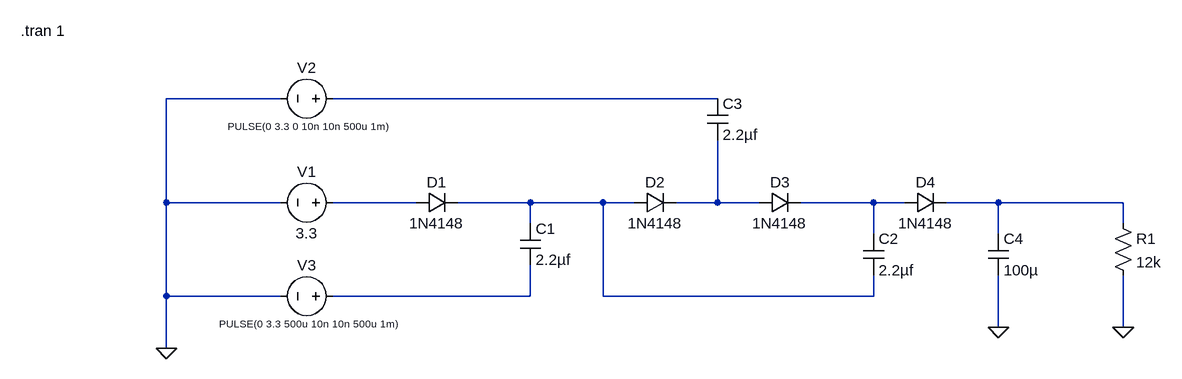
[diagram p0: schematic cockcroft.asc]
cockcroft.asc, the LTspice schematic file:
Version 4.1
SHEET 1 1428 680
WIRE 64 0 -112 0
WIRE 736 0 144 0
WIRE -112 160 -112 0
WIRE 64 160 -112 160
WIRE 272 160 144 160
WIRE 448 160 336 160
WIRE 560 160 448 160
WIRE 608 160 560 160
WIRE 736 160 736 64
WIRE 736 160 672 160
WIRE 800 160 736 160
WIRE 976 160 864 160
WIRE 1024 160 976 160
WIRE 1168 160 1088 160
WIRE 1360 160 1168 160
WIRE 448 192 448 160
WIRE 1360 192 1360 160
WIRE 976 208 976 160
WIRE 1168 208 1168 160
WIRE -112 304 -112 160
WIRE 64 304 -112 304
WIRE 448 304 448 256
WIRE 448 304 144 304
WIRE 560 304 560 160
WIRE 976 304 976 272
WIRE 976 304 560 304
WIRE 1168 352 1168 272
WIRE 1360 352 1360 272
WIRE -112 384 -112 304
FLAG -112 384 0
FLAG 1168 352 0
FLAG 1360 352 0
SYMBOL voltage 160 160 R90
WINDOW 0 -32 56 VBottom 2
WINDOW 3 32 56 VTop 2
WINDOW 123 0 0 Left 0
WINDOW 39 0 0 Left 0
SYMATTR InstName V1
SYMATTR Value 3.3
SYMBOL voltage 160 0 R90
WINDOW 0 -32 56 VBottom 2
WINDOW 3 32 56 VTop 1
WINDOW 123 0 0 Left 0
WINDOW 39 0 0 Left 0
SYMATTR InstName V2
SYMATTR Value PULSE(0 3.3 0 10n 10n 500u 1m)
SYMBOL voltage 160 304 R90
WINDOW 0 -32 56 VBottom 2
WINDOW 3 32 56 VTop 1
WINDOW 123 0 0 Left 0
WINDOW 39 0 0 Left 0
SYMATTR InstName V3
SYMATTR Value PULSE(0 3.3 500u 10n 10n 500u 1m)
SYMBOL diode 272 176 R270
WINDOW 0 32 32 VTop 2
WINDOW 3 0 32 VBottom 2
SYMATTR InstName D1
SYMATTR Value 1N4148
SYMBOL cap 432 192 R0
SYMATTR InstName C1
SYMATTR Value 2.2µf
SYMBOL diode 608 176 R270
WINDOW 0 32 32 VTop 2
WINDOW 3 0 32 VBottom 2
SYMATTR InstName D2
SYMATTR Value 1N4148
SYMBOL diode 800 176 R270
WINDOW 0 32 32 VTop 2
WINDOW 3 0 32 VBottom 2
SYMATTR InstName D3
SYMATTR Value 1N4148
SYMBOL cap 960 208 R0
SYMATTR InstName C2
SYMATTR Value 2.2µf
SYMBOL cap 720 0 R0
SYMATTR InstName C3
SYMATTR Value 2.2µf
SYMBOL cap 1152 208 R0
SYMATTR InstName C4
SYMATTR Value 100µ
SYMBOL res 1344 176 R0
SYMATTR InstName R1
SYMATTR Value 12k
SYMBOL diode 1024 176 R270
WINDOW 0 32 32 VTop 2
WINDOW 3 0 32 VBottom 2
SYMATTR InstName D4
SYMATTR Value 1N4148
TEXT -336 -104 Left 2 !.tran 1

The netlist it stands for:
* cockcroft.asc
V1 N002 0 3.3
V2 N001 0 PULSE(0 3.3 0 10n 10n 500u 1m)
V3 N007 0 PULSE(0 3.3 500u 10n 10n 500u 1m)
D1 N002 N003 1N4148
C1 N003 N007 2.2µf
D2 N003 N004 1N4148
D3 N004 N005 1N4148
C2 N005 N003 2.2µf
C3 N001 N004 2.2µf
C4 N006 0 100µ
R1 N006 0 12k
D4 N005 N006 1N4148
.model D D
.lib standard.dio
.tran 1
.backanno
.end